# Altium schematic sheet 08 NAND-eMMC.SchDoc
size 420 x 297 mm
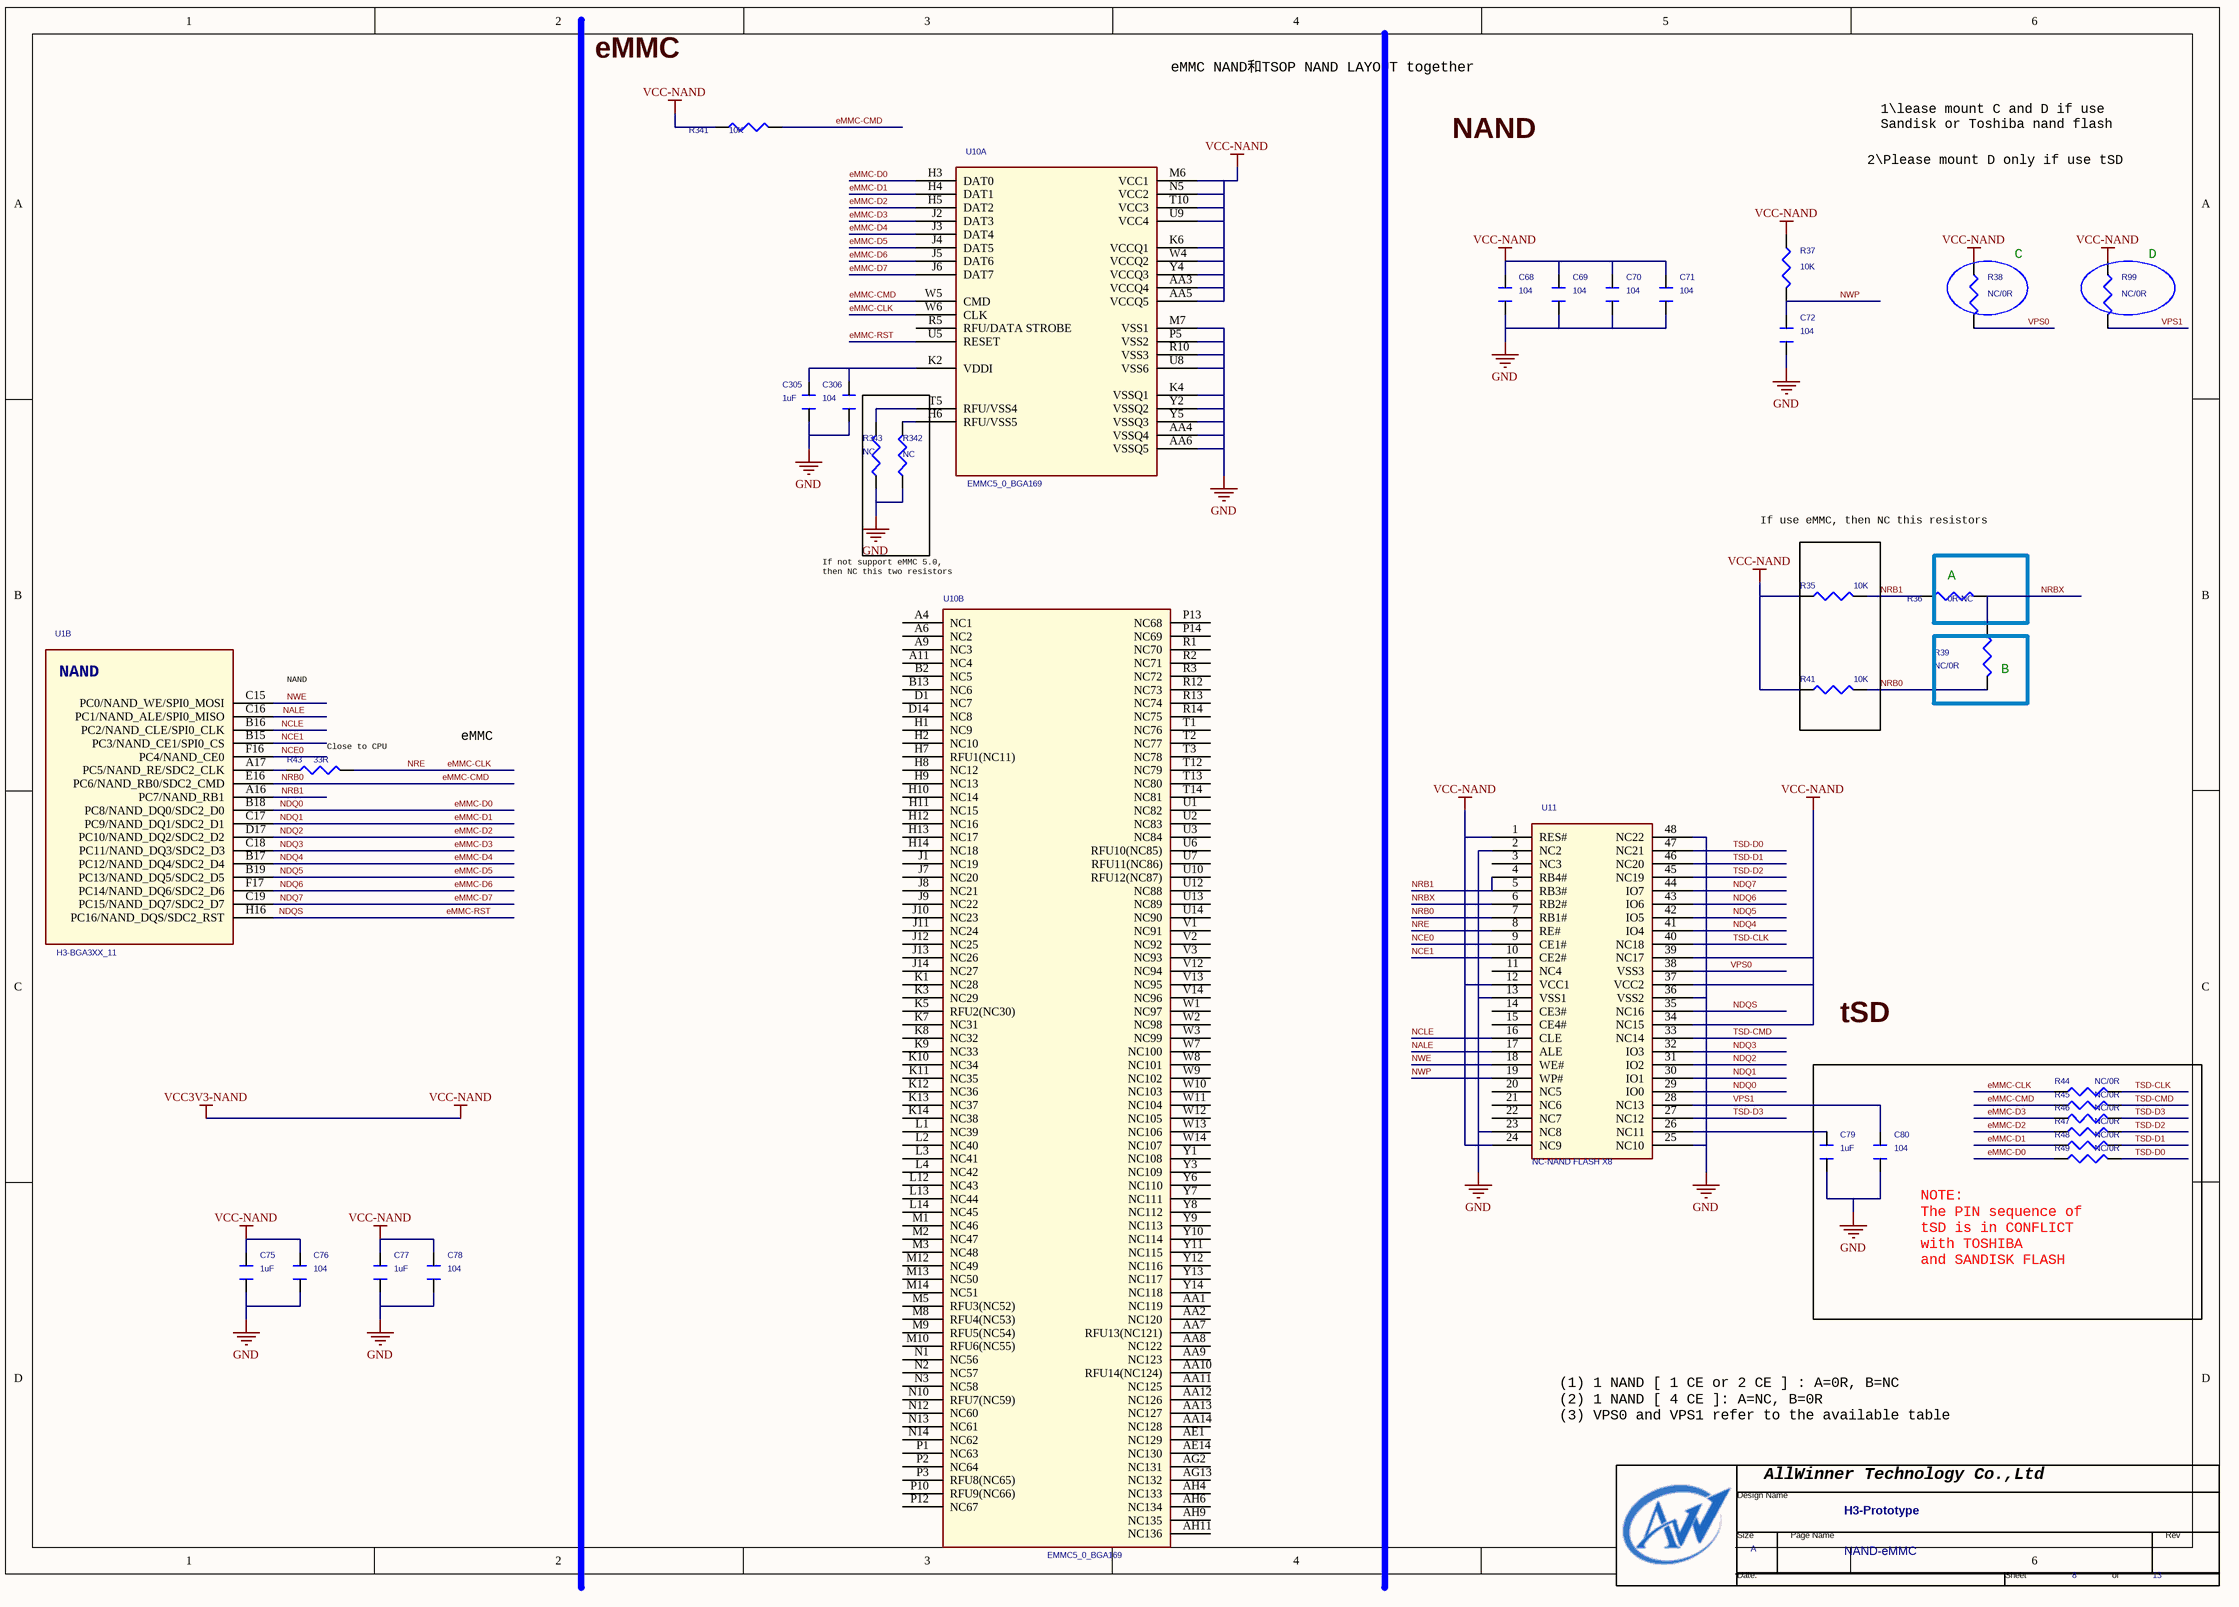
[diagram p0: 08 NAND-eMMC.SchDoc]

## Parts
*  Page Count: 13  Page Number: 8  Page Size: A  Title: H3-Prototype  Doc: NAND-eMMC  (hidden comment: TitleBlock0-AW)  (graphical)
C68  104  [C0402]
C69  104  [C0402]
C70  104  [C0402]
C71  104  [C0402]
C72  104  [C0402]
C75  1uF  [C0402]
C76  104  [C0402]
C77  1uF  [C0402]
C78  104  [C0402]
C79  1uF  [C0402]
C80  104  [C0402]
C305  1uF  [C0402]
C306  104  [C0402]
R35  10K  [R0402]
R36  0R-NC  [R0402]
R37  10K  [R0402]
R38  NC/0R  [R0402]
R39  NC/0R  [R0402]
R41  10K  [R0402]
R43  33R  [R0402]
R44  NC/0R  [R0402]
R45  NC/0R  [R0402]
R46  NC/0R  [R0402]
R47  NC/0R  [R0402]
R48  NC/0R  [R0402]
R49  NC/0R  [R0402]
R99  NC/0R  [R0402]
R341  10K  [R0402]
R342  NC  [R0402]
R343  NC  [R0402]
U1  H3-BGA3XX_11  [BGA347P0_65B14X14]  (part B of 9)
U10  EMMC5_0_BGA169  [BGA169P0_50B12_00X16_00H1_00]  (parts A,B of 2)
U11  NC-NAND FLASH X8  [TSOP-48]

## Blocks framed on the sheet
A: R36
B: R39

## Nets
GND: C68.1 C69.1 C70.1 C71.1 C72.1 C75.1 C76.1 C77.1 C78.1 C79.1 C80.1 C305.1 C306.1 R342.1 R343.1 U10.AA4(VSSQ4) U10.AA6(VSSQ5) U10.K4(VSSQ1) U10.M7(VSS1) U10.P5(VSS2) U10.R10(VSS3) U10.U8(VSS6) U10.Y2(VSSQ2) U10.Y5(VSSQ3) U11.2(NC2) U11.13(VSS1) U11.23(NC8) U11.25(NC10) U11.36(VSS2) U11.48(NC22)
VCC-NAND: C68.2 C69.2 C70.2 C71.2 C75.2 C76.2 C77.2 C78.2 R35.1 R37.1 R38.1 R41.1 R99.1 R341.1 U10.AA3(VCCQ4) U10.AA5(VCCQ5) U10.K6(VCCQ1) U10.M6(VCC1) U10.N5(VCC2) U10.T10(VCC3) U10.U9(VCC4) U10.W4(VCCQ2) U10.Y4(VCCQ3) U11.1(RES#) U11.12(VCC1) U11.24(NC9) U11.34(NC15) U11.37(VCC2) U11.39(NC17)  [also labelled VCC3V3-NAND]
eMMC-CLK: R43.2 R44.1 U10.W6(CLK) U11.8(RE#)  [also labelled NRE]
eMMC-CMD: R39.2 R41.2 R45.1 R341.2 U1.E16(PC6/NAND_RB0/SDC2_CMD) U10.W5(CMD) U11.7(RB1#)  [also labelled NRB0]
eMMC-D0: R49.1 U1.B18(PC8/NAND_DQ0/SDC2_D0) U10.H3(DAT0) U11.29(IO0)  [also labelled NDQ0]
eMMC-D1: R48.1 U1.C17(PC9/NAND_DQ1/SDC2_D1) U10.H4(DAT1) U11.30(IO1)  [also labelled NDQ1]
eMMC-D2: R47.1 U1.D17(PC10/NAND_DQ2/SDC2_D2) U10.H5(DAT2) U11.31(IO2)  [also labelled NDQ2]
eMMC-D3: R46.1 U1.C18(PC11/NAND_DQ3/SDC2_D3) U10.J2(DAT3) U11.32(IO3)  [also labelled NDQ3]
eMMC-D4: U1.B17(PC12/NAND_DQ4/SDC2_D4) U10.J3(DAT4) U11.41(IO4)  [also labelled NDQ4]
eMMC-D5: U1.B19(PC13/NAND_DQ5/SDC2_D5) U10.J4(DAT5) U11.42(IO5)  [also labelled NDQ5]
eMMC-D6: U1.F17(PC14/NAND_DQ6/SDC2_D6) U10.J5(DAT6) U11.43(IO6)  [also labelled NDQ6]
eMMC-D7: U1.C19(PC15/NAND_DQ7/SDC2_D7) U10.J6(DAT7) U11.44(IO7)  [also labelled NDQ7]
eMMC-RST: U1.H16(PC16/NAND_DQS/SDC2_RST) U10.U5(RESET) U11.35(NC16)  [also labelled NDQS]
NALE: U1.C16(PC1/NAND_ALE/SPI0_MISO) U11.17(ALE)
NCE0: U1.F16(PC4/NAND_CE0) U11.9(CE1#)
NCE1: U1.B15(PC3/NAND_CE1/SPI0_CS) U11.10(CE2#)
NCLE: U1.B16(PC2/NAND_CLE/SPI0_CLK) U11.16(CLE)
NRB1: R35.2 R36.1 U1.A16(PC7/NAND_RB1) U11.4(RB4#) U11.5(RB3#)
NRBX: R36.2 R39.1 U11.6(RB2#)
NWE: U1.C15(PC0/NAND_WE/SPI0_MOSI) U11.18(WE#)
NWP: C72.2 R37.2 U11.19(WP#)
TSD-CLK: R44.2 U11.40(NC18)
TSD-CMD: R45.2 U11.33(NC14)
TSD-D0: R49.2 U11.47(NC21)
TSD-D1: R48.2 U11.46(NC20)
TSD-D2: R47.2 U11.45(NC19)
TSD-D3: R46.2 U11.27(NC12)
VPS0: R38.2 U11.38(VSS3)
VPS1: C80.2 R99.2 U11.28(NC13)
NetC79_2: C79.2 U11.26(NC11)
NetC305_2: C305.2 C306.2 U10.K2(VDDI)
NetR43_1: R43.1 U1.A17(PC5/NAND_RE/SDC2_CLK)
NetR342_2: R342.2 U10.H6(RFU/VSS5)
NetR343_2: R343.2 U10.T5(RFU/VSS4)

Not connected (* = marked no-connect by the designer): U10 A4(NC1) A6(NC2) A9(NC3) A11(NC4) AA1(NC119) AA2(NC120) AA7(RFU13(NC121)) AA8(NC122) AA9(NC123) AA10(RFU14(NC124)) AA11(NC125) AA12(NC126) AA13(NC127) AA14(NC128) AE1(NC129) AE14(NC130) AG2(NC131) AG13(NC132) AH4(NC133) AH6(NC134) AH9(NC135) AH11(NC136) B2(NC5) B13(NC6) D1(NC7) D14(NC8) H1(NC9) H2(NC10) H7(RFU1(NC11)) H8(NC12) H9(NC13) H10(NC14) H11(NC15) H12(NC16) H13(NC17) H14(NC18) J1(NC19) J7(NC20) J8(NC21) J9(NC22) J10(NC23) J11(NC24) J12(NC25) J13(NC26) J14(NC27) K1(NC28) K3(NC29) K5(RFU2(NC30)) K7(NC31) K8(NC32) K9(NC33) K10(NC34) K11(NC35) K12(NC36) K13(NC37) K14(NC38) L1(NC39) L2(NC40) L3(NC41) L4(NC42) L12(NC43) L13(NC44) L14(NC45) M1(NC46) M2(NC47) M3(NC48) M5(RFU3(NC52)) M8(RFU4(NC53)) M9(RFU5(NC54)) M10(RFU6(NC55)) M12(NC49) M13(NC50) M14(NC51) N1(NC56) N2(NC57) N3(NC58) N10(RFU7(NC59)) N12(NC60) N13(NC61) N14(NC62) P1(NC63) P2(NC64) P3(RFU8(NC65)) P10(RFU9(NC66)) P12(NC67) P13(NC68) P14(NC69) R1(NC70) R2(NC71) R3(NC72) R5(RFU/DATA_STROBE) R12(NC73) R13(NC74) R14(NC75) T1(NC76) T2(NC77) T3(NC78) T12(NC79) T13(NC80) T14(NC81) U1(NC82) U2(NC83) U3(NC84) U6(RFU10(NC85)) U7(RFU11(NC86)) U10(RFU12(NC87)) U12(NC88) U13(NC89) U14(NC90) V1(NC91) V2(NC92) V3(NC93) V12(NC94) V13(NC95) V14(NC96) W1(NC97) W2(NC98) W3(NC99) W7(NC100) W8(NC101) W9(NC102) W10(NC103) W11(NC104) W12(NC105) W13(NC106) W14(NC107) Y1(NC108) Y3(NC109) Y6(NC110) Y7(NC111) Y8(NC112) Y9(NC113) Y10(NC114) Y11(NC115) Y12(NC116) Y13(NC117) Y14(NC118); U11 3(NC3) 11(NC4) 14(CE3#) 15(CE4#) 20(NC5) 21(NC6) 22(NC7)

## Notes on the sheet
- eMMC
- eMMC NAND和TSOP NAND LAYOUT together
- 1\lease mount C and D if use
  Sandisk or Toshiba nand flash
- NAND
- 2\Please mount D only if use tSD
- (near R38) C
- (near R99) D
- If use eMMC, then NC this resistors
- (near U10) If not support eMMC 5.0,
  then NC this two resistors
- (near R43) Close to CPU
- tSD
- NOTE:
  The PIN sequence of
  tSD is in CONFLICT
  with TOSHIBA
  and SANDISK FLASH
- (near *) (1) 1 NAND [ 1 CE or 2 CE ] : A=0R, B=NC
  (2) 1 NAND [ 4 CE ]: A=NC, B=0R
  (3) VPS0 and VPS1 refer to the available table
- (in symbol H3-BGA3XX_12, part B) NAND
- (in symbol TitleBlock0-AW) AllWinner Technology Co.,Ltd; Design Name; Size; Page Name; Rev; Date:; Sheet; of

## Library data of the parts
C68-C71 C75 C77 C79 C80 C305 = CAPACITOR_0_Dup5: PAGE: 2; mypage: 08
C72 C76 C78 C306 = CAPACITOR_0_Dup5: mypage: 08; PAGE: 2
R35 R37 R38 R41 R43-R49 R99 R341-R343 = R_Dup4: mypage: 08
R36 R39 = R_Dup3: mypage: 08
U1 = H3-BGA3XX_12
U11 = NAND_FLASH_X8: mypage: 08
* = TitleBlock0-AW: Page Create Date: March  8, 1995